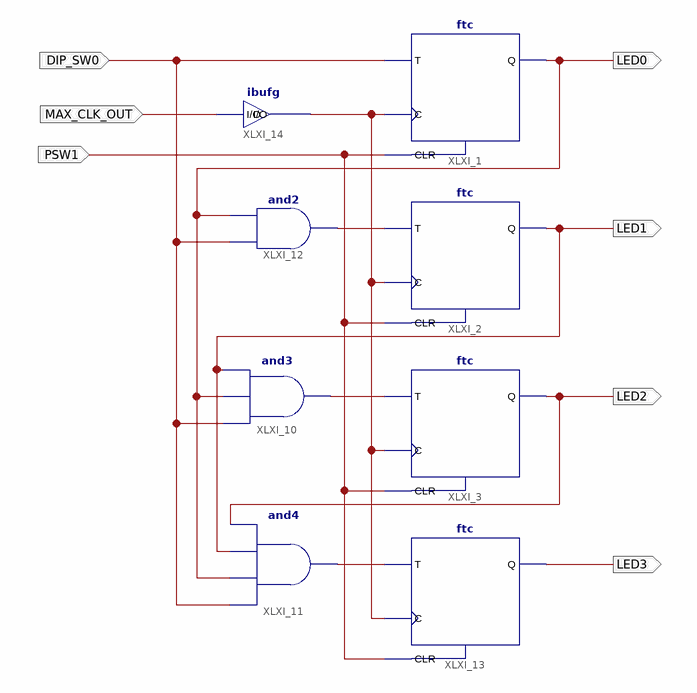
[diagram p0: schematic sheet 1]
// Xilinx ISE schematic lab7_2_counter.sch (spartan3) as structural Verilog: 8 symbols, 7 ports
module lab7_2_counter (
  input  MAX_CLK_OUT,
  input  DIP_SW0,
  input  PSW1,
  output LED3,
  output LED0,
  output LED1,
  output LED2
);

  wire XLXN_4, XLXN_5, XLXN_7;

  ftc XLXI_1 (.C(MAX_CLK_OUT), .CLR(PSW1), .T(DIP_SW0), .Q(LED0));
  ftc XLXI_2 (.C(MAX_CLK_OUT), .CLR(PSW1), .T(XLXN_7), .Q(LED1));
  ftc XLXI_3 (.C(MAX_CLK_OUT), .CLR(PSW1), .T(XLXN_4), .Q(LED2));
  and XLXI_10 (XLXN_4, DIP_SW0, LED0, LED1);
  and XLXI_11 (XLXN_5, DIP_SW0, LED0, LED1, LED2);
  and XLXI_12 (XLXN_7, DIP_SW0, LED0);
  ftc XLXI_13 (.C(MAX_CLK_OUT), .CLR(PSW1), .T(XLXN_5), .Q(LED3));
  ibufg XLXI_14 (.I(MAX_CLK_OUT), .O(MAX_CLK_OUT));
endmodule
